# Altium schematic sheet _nRF9160.SchDoc: nRF9160, SIM and GPIOs
size A3; CompanyName: Nordic Semiconductor ASA; DrawnBy: EISK; SheetNumber: 2; SheetTotal: 4; DesignStatus: Prototype; Version: 0.1.2
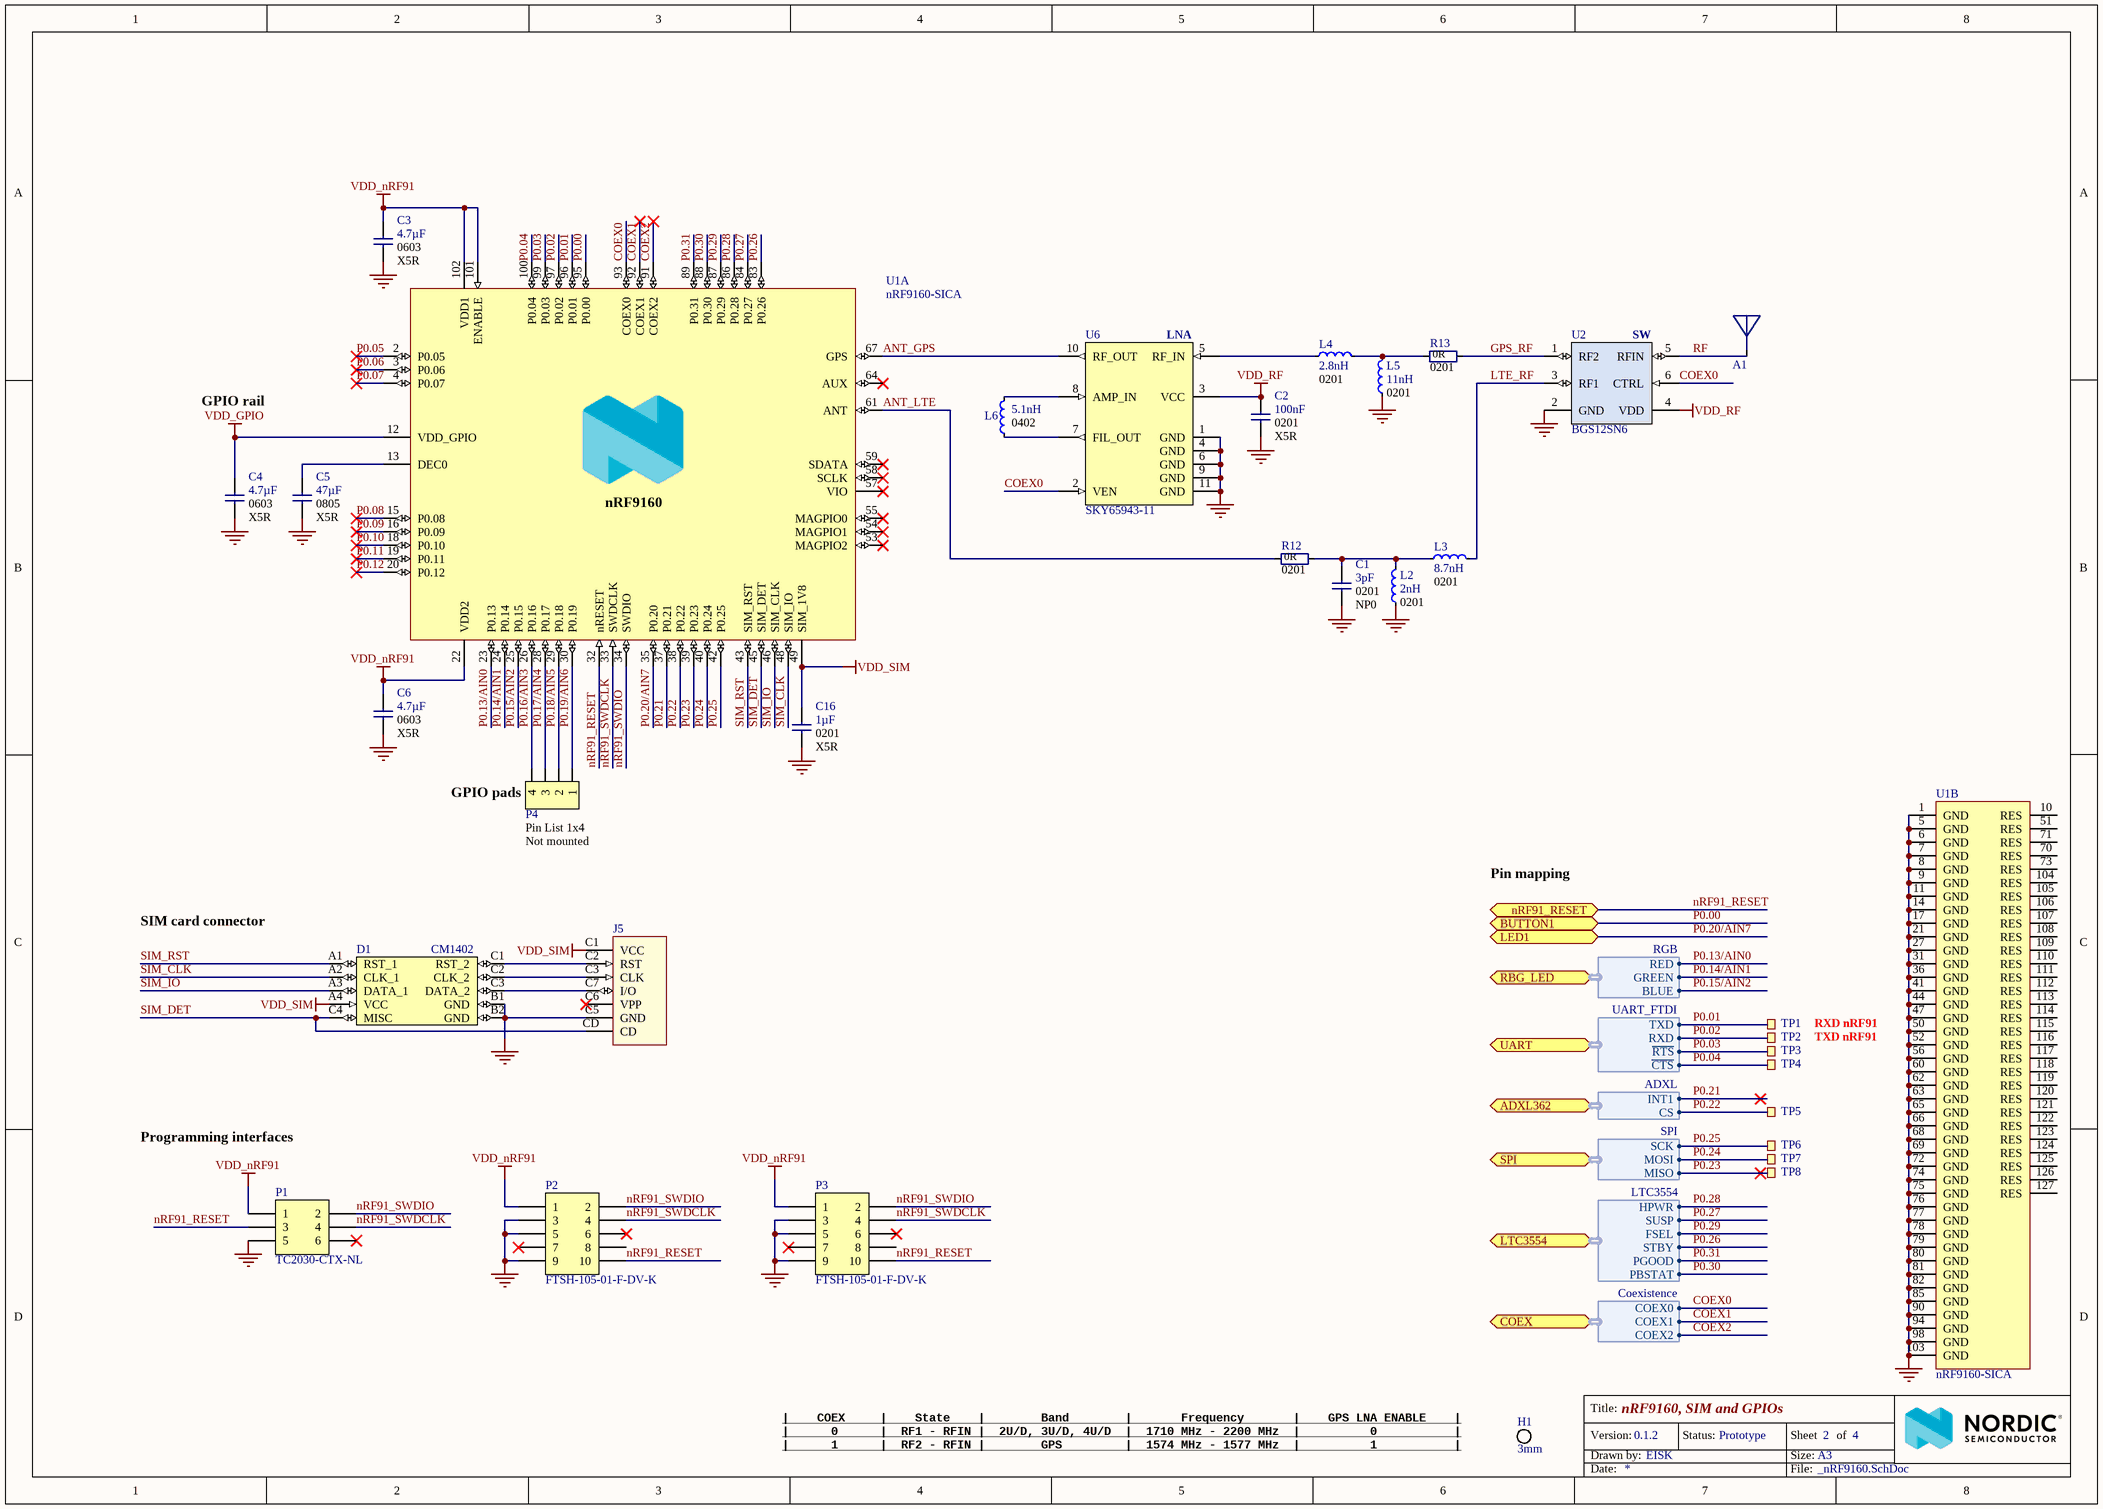
[diagram p0: _nRF9160.SchDoc]

## Parts
A1  FR01-S4-250  [FRACTUS_CUBE_mXTEND]  (value not drawn)
C1  3pF  Footprint Doc: 0201  TempCoeff: NP0  [CAPC0603X03L_C]
C2  100nF  Footprint Doc: 0201  TempCoeff: X5R  [CAPC0603X03L_C]
C3  4.7µF  Footprint Doc: 0603  TempCoeff: X5R  [CAPC1608X06L]
C4  4.7µF  Footprint Doc: 0603  TempCoeff: X5R  [CAPC1608X06L]
C5  47µF  Footprint Doc: 0805  TempCoeff: X5R  [CAPC2012X11L]
C6  4.7µF  Footprint Doc: 0603  TempCoeff: X5R  [CAPC1608X06L]
C16  1µF  Footprint Doc: 0201  TempCoeff: X5R  [CAPC0603X03L_C]
D1  CM1402  [CM1402]
H1  3mm  [HOLE_NP_3MM]  (no BOM)
J5  SIM8055-6-1-14-00-A_revA1  [GCT_SIM8055-6-1-14-00-A_revA1]  (value not drawn)
L2  2nH  Footprint Doc: 0201  [INDC0603X03L_C]
L3  8.7nH  Footprint Doc: 0201  [INDC0603X03L_C]
L4  2.8nH  Footprint Doc: 0201  [INDC0603X03L_C]
L5  11nH  Footprint Doc: 0201  [INDC0603X03L_C]
L6  5.1nH  Footprint Doc: 0402  [INDC1005X04L_WW]
P1  TC2030-CTX-NL  [TC2030-IDC-NLFP]  (no BOM)
P2  FTSH-105-01-F-DV-K  [HDR_2x5-SMD-1.27mm]  (no BOM)
P3  FTSH-105-01-F-DV-K  [HDR_2x5-SMD-1.27mm-K]  (no BOM)
P4  Pin List 1x4  Assembly: Not mounted  [LIST_1x4-NC]  (no BOM)
R12  0R  Footprint Doc: 0201  [RESC0603X03L_C]
R13  0R  Footprint Doc: 0201  [RESC0603X03L_C]
TP1  Ø1.0mm,SMD  [TP_SMD_Ø1.0mm]  (value not drawn)  (no BOM)
TP2  Ø1.0mm,SMD  [TP_SMD_Ø1.0mm]  (value not drawn)  (no BOM)
TP3  Ø1.0mm,SMD  [TP_SMD_Ø1.0mm]  (value not drawn)  (no BOM)
TP4  Ø1.0mm,SMD  [TP_SMD_Ø1.0mm]  (value not drawn)  (no BOM)
TP5  Ø1.0mm,SMD  [TP_SMD_Ø1.0mm]  (value not drawn)  (no BOM)
TP6  Ø1.0mm,SMD  [TP_SMD_Ø1.0mm]  (value not drawn)  (no BOM)
TP7  Ø1.0mm,SMD  [TP_SMD_Ø1.0mm]  (value not drawn)  (no BOM)
TP8  Ø1.0mm,SMD  [TP_SMD_Ø1.0mm]  (value not drawn)  (no BOM)
U1  nRF9160-SICA  [LGA50P1600X1050X104-161N]  (parts A,B of 2)
U2  BGS12SN6  [PG-TSNP-6-2]
U6  SKY65943-11  [SKY6594311]

## Ports
ADXL362 (bidir, harness ADXL), BUTTON1 (bidir), COEX (bidir, harness Coexistence), LED1 (bidir), LTC3554 (bidir, harness LTC3554), nRF91_RESET (bidir), RBG_LED (bidir, harness RGB), SPI (bidir, harness SPI), UART (bidir, harness UART_FTDI)

## Harnesses
SPI: MISO, MOSI, SCK
ADXL: CS, INT1
UART_FTDI: RXD, TXD, ~{CTS}, ~{RTS}
LTC3554: HPWR, SUSP, FSEL, STBY, PGOOD, PBSTAT
RGB: RED, GREEN, BLUE
Coexistence: COEX2, COEX1, COEX0

## Nets
GND: C1.2 C2.2 C3.2 C4.2 C5.2 C6.2 C16.2 D1.B1(GND) D1.B2(GND) J5.C5(GND) L2.1 L5.1 P1.5 P2.3 P2.5 P2.9 P3.3 P3.5 P3.9 U1.1(GND) U1.5(GND) U1.6(GND) U1.7(GND) U1.8(GND) U1.9(GND) U1.11(GND) U1.14(GND) U1.17(GND) U1.21(GND) U1.27(GND) U1.31(GND) U1.36(GND) U1.41(GND) U1.44(GND) U1.47(GND) U1.50(GND) U1.52(GND) U1.56(GND) U1.60(GND) U1.62(GND) U1.63(GND) U1.65(GND) U1.66(GND) U1.68(GND) U1.69(GND) U1.72(GND) U1.74(GND) U1.75(GND) U1.76(GND) U1.77(GND) U1.78(GND) U1.79(GND) U1.80(GND) U1.81(GND) U1.82(GND) U1.85(GND) U1.90(GND) U1.94(GND) U1.98(GND) U1.103(GND) U2.2(GND) U6.1(GND) U6.4(GND) U6.6(GND) U6.9(GND) U6.11(GND)
VDD_GPIO: C4.1 U1.12(VDD_GPIO)
VDD_nRF91: C3.1 C6.1 P1.1 P2.1 P3.1 U1.22(VDD2) U1.101(ENABLE) U1.102(VDD1)
VDD_RF: C2.1 U2.4(VDD) U6.3(VCC)
VDD_SIM: C16.1 D1.A4(VCC) J5.C1(VCC) U1.49(SIM_1V8)
ANT_GPS: U1.67(GPS) U6.10(RF_OUT)
ANT_LTE: R12.1 U1.61(ANT)
COEX0: U1.93(COEX0) U2.6(CTRL) U6.2(VEN) ; port COEX.COEX0
COEX1: U1.92(COEX1) ; port COEX.COEX1
COEX2: U1.91(COEX2) ; port COEX.COEX2
GPS_RF: R13.2 U2.1(RF2)
LTE_RF: L3.2 U2.3(RF1)
nRF91_RESET: P1.3 P2.10 P3.10 U1.32(nRESET) ; port nRF91_RESET
nRF91_SWDCLK: P1.4 P2.4 P3.4 U1.33(SWDCLK)
nRF91_SWDIO: P1.2 P2.2 P3.2 U1.34(SWDIO)
P0.00: U1.95(P0.00) ; port BUTTON1
P0.01: TP1.1 U1.96(P0.01) ; port UART.TXD
P0.02: TP2.1 U1.97(P0.02) ; port UART.RXD
P0.03: TP3.1 U1.99(P0.03) ; port UART.~{RTS}
P0.04: TP4.1 U1.100(P0.04) ; port UART.~{CTS}
P0.05: U1.2(P0.05)
P0.06: U1.3(P0.06)
P0.07: U1.4(P0.07)
P0.08: U1.15(P0.08)
P0.09: U1.16(P0.09)
P0.10: U1.18(P0.10)
P0.11: U1.19(P0.11)
P0.12: U1.20(P0.12)
P0.13/AIN0: U1.23(P0.13) ; port RBG_LED.RED
P0.14/AIN1: U1.24(P0.14) ; port RBG_LED.GREEN
P0.15/AIN2: U1.25(P0.15) ; port RBG_LED.BLUE
P0.16/AIN3: P4.4 U1.26(P0.16)
P0.17/AIN4: P4.3 U1.28(P0.17)
P0.18/AIN5: P4.2 U1.29(P0.18)
P0.19/AIN6: P4.1 U1.30(P0.19)
P0.20/AIN7: U1.35(P0.20) ; port LED1
P0.21: U1.37(P0.21) ; port ADXL362.INT1
P0.22: TP5.1 U1.38(P0.22) ; port ADXL362.CS
P0.23: TP8.1 U1.39(P0.23) ; port SPI.MISO
P0.24: TP7.1 U1.40(P0.24) ; port SPI.MOSI
P0.25: TP6.1 U1.42(P0.25) ; port SPI.SCK
P0.26: U1.83(P0.26) ; port LTC3554.STBY
P0.27: U1.84(P0.27) ; port LTC3554.SUSP
P0.28: U1.86(P0.28) ; port LTC3554.HPWR
P0.29: U1.87(P0.29) ; port LTC3554.FSEL
P0.30: U1.88(P0.30) ; port LTC3554.PBSTAT
P0.31: U1.89(P0.31) ; port LTC3554.PGOOD
RF: A1.1 U2.5(RFIN)
SIM_CLK: D1.A2(CLK_1) U1.48(SIM_IO)
SIM_DET: D1.C4(MISC) J5.CD U1.45(SIM_DET)
SIM_IO: D1.A3(DATA_1) U1.46(SIM_CLK)
SIM_RST: D1.A1(RST_1) U1.43(SIM_RST)
NetC1_1: C1.1 L2.2 L3.1 R12.2
NetC5_1: C5.1 U1.13(DEC0)
NetD1_C1: D1.C1(RST_2) J5.C2(RST)
NetD1_C2: D1.C2(CLK_2) J5.C3(CLK)
NetD1_C3: D1.C3(DATA_2) J5.C7(I/O)
NetL4_1: L4.1 U6.5(RF_IN)
NetL4_2: L4.2 L5.2 R13.1
NetL6_1: L6.1 U6.7(FIL_OUT)
NetL6_2: L6.2 U6.8(AMP_IN)

Not connected (* = marked no-connect by the designer): J5 C6(VPP)*; P1 6*; P2 6* 7* 8; P3 6* 7* 8; U1 10(RES) 51(RES) 53(MAGPIO2)* 54(MAGPIO1)* 55(MAGPIO0)* 57(VIO)* 58(SCLK)* 59(SDATA)* 64(AUX)* 70(RES) 71(RES) 73(RES) 104(RES) 105(RES) 106(RES) 107(RES) 108(RES) 109(RES) 110(RES) 111(RES) 112(RES) 113(RES) 114(RES) 115(RES) 116(RES) 117(RES) 118(RES) 119(RES) 120(RES) 121(RES) 122(RES) 123(RES) 124(RES) 125(RES) 126(RES) 127(RES)

## Notes on the sheet
- (near U6) LNA
- (near U2) SW
- GPIO rail
- (near P4) GPIO pads
- Pin mapping
- SIM card connector
- RXD nRF91
- TXD nRF91
- Programming interfaces
- (near H1) |    COEX     |    State    |        Band        |       Frequency       |    GPS LNA ENABLE    |
  |      0      |  RF1 - RFIN |  2U/D, 3U/D, 4U/D  |  1710 MHz - 2200 MHz  |          0           |
  |      1      |  RF2 - RFIN |        GPS         |  1574 MHz - 1577 MHz  |          1           |
- Title:
- Version:
- Drawn by:
- Status:
- Size:
- Sheet
- A3
- of
- Date:
- File:
- (in symbol nRF9160_SICA, part A) nRF9160

## Library data of the parts
A1 = ANT:CUBE_mXTEND: CUBE mXTEND Antenna Booster (GSM, UMTS, LTE); Manufacturer: Fractus Antennas S.L.; Supplier 1: Digi-Key; Supplier Part Number 1: 2115-FR01-S4-250CT-ND; Manufacturer Part Number: FR01-S4-250; ComponentLink1Description: Datasheet; ComponentLink1URL: https://www.fractusantennas.com/wp-content/uploads/2018/01/UM_FR01-S4-250.pdf; Value: FR01-S4-250; ComponentLink2Description: Digi-Key; ComponentLink2URL: https://www.digikey.no/product-detail/en/fractus-antennas-s-l/FR01-S4-250/2115-FR01-S4-250CT-ND/10108319
C1 = CAP:0201: Capacitor, NP0, ±10%, 10V; Artikkelnr Noca: N.A.; Manufacturer: *; Manufacturer Part Number: *; LatestRevisionDate: 2014-11-13; Pin Count: 2; Publisher: Nordic Semiconductor; Published: 2014-11-13; Value: 3pF; Note: 10V; HelpURL: *; Supplier 1: *; Supplier Part Number 1: *; Supplier 2: *; Supplier Part Number 2: *
C2 C16 = CAP:0201: Capacitor, X5R, ±10%, 10V; Artikkelnr Noca: N.A.; Manufacturer: *; Manufacturer Part Number: *; LatestRevisionDate: 2014-11-13; Pin Count: 2; Publisher: Nordic Semiconductor; Published: 2014-11-13; HelpURL: *; Supplier 1: *; Supplier Part Number 1: *; Supplier 2: *; Supplier Part Number 2: *
  C2: Value: 100nF; Note: *
  C16: Value: 1µF; Note: 10V
C3 C4 C6 = CAP:0603: Capacitor, X5R, ±10%, 6.3V; Artikkelnr Noca: N.A.; Manufacturer: *; Manufacturer Part Number: *; LatestRevisionDate: 2014-11-13; Pin Count: 2; Publisher: Nordic Semiconductor; Published: 2014-11-13; Value: 4.7µF; Note: 6.3V; HelpURL: *; Supplier 1: *; Supplier Part Number 1: *; Supplier 2: *; Supplier Part Number 2: *
C5 = CAP:0805: Capacitor, X5R, ±20%, 6.3V; Note: s; Artikkelnr Noca: N.A.; Manufacturer: *; Manufacturer Part Number: *; LatestRevisionDate: 2014-11-13; Pin Count: 2; Publisher: Nordic Semiconductor; Published: 2014-11-13; HelpURL: *; Supplier 1: *; Supplier Part Number 1: *; Supplier 2: *; Supplier Part Number 2: *; Value: 47µF
D1 = CM1402: EMI Network Filter Arrays SIM CARD EMI FILTER WITH ESD PROTECTION; Manufacturer: ON Semiconductor; Manufacturer Part Number: CM1402-03CP; Artikkelnr Noca: N.A.; Part Number: CM1402; Footprint Doc: CM1402; LatestRevisionDate: 2017-02-06; Publisher: Nordic Semiconductor; Published: 2017-02-06; Value: CM1402; Note: *; ComponentLink1URL: *; ComponentLink1Description: Datasheet; ComponentLink2URL: *; ComponentLink2Description: Supplier link; Pin Count: 10; Supplier 1: Mouser; Supplier Part Number 1: 748-CM1402-03CP; Supplier 2: Digi-Key; Supplier Part Number 2: CM1402-03CPOSCT-ND; Part number IPS: N.A.; Datasheet: http://www.onsemi.com/pub_link/Collateral/CM1402-D.PDF
H1 = HOLE:M3: Value: 3mm
J5 = SIM8055-6-1-14-00-A_revA1: Nano SIM Card Connector, Push-Pull Type, 6 Pin, SMT, Profile 1.35mm; Manufacturer: GCT; Manufacturer Part Number: SIM8055-6-1-14-00-A; Supplier: Digi-Key; Supplier Part Number: 2073-SIM8055-6-1-14-00-ADKR-ND; ComponentLink1Description: Information Page; ComponentLink1URL: https://gct.co/connector/digi-key/sim8055; ComponentLink2Description: Digi-Key; ComponentLink2URL: https://www.digikey.com/product-detail/en/gct/SIM8055-6-1-14-00-A/2073-SIM8055-6-1-14-00-ADKR-ND/9859771
L2-L5 = IND:0201: Inductor, 350mA, ±3%; Manufacturer: Murata; Manufacturer Part Number: *; HelpURL: *; LatestRevisionDate: 2017-07-19; Pin Count: 2; Publisher: Nordic Semiconductor; Published: 2013-04-10; Note: *; Supplier 1: *; Supplier Part Number 1: *; Supplier 2: *; Supplier Part Number 2: *
  L2: Value: 2nH
  L3: Value: 8.7nH
  L4: Value: 2.8nH
  L5: Value: 11nH
L6 = IND:Murata: Inductor, 600mA, ±0.1nH, 120mΩ, Q=25; Part Number: L0402-5n1-Wirewound-Murata; Manufacturer: Murata; Manufacturer Part Number: LQW15AN5N1B00; Note: -55°C ~ 125°C; Artikkelnr Noca: N.A.; ComponentLink1URL: https://search.murata.co.jp/Ceramy/image/img/P02/JELF243A-0050.pdf; ComponentLink1Description: Datasheet; ComponentLink2URL: *; ComponentLink2Description: Supplier link; HelpURL: https://psearch.en.murata.com/inductor/product/LQW15AN5N1B00%23.html; LatestRevisionDate: 2019-04-16; Pin Count: 2; Publisher: Nordic Semiconductor; Published: 2019-04-16; Value: 5.1nH; Supplier 1: Digi-Key; Supplier Part Number 1: 490-6831-1-ND; Part number IPS: N.A.
P1 = CONN-2x3_No_BOM: CBL PLUG-OF-NAILS 6-PIN; Manufacturer: Tag-Connect LLC; Artikkelnr Noca: N.A.; Part Number: TC2030-CTX-NL; Manufacturer Part Number: TC2030-CTX-NL; Datasheet: http://www.tag-connect.com/Materials/TC2030-IDC-NL.pdf; LatestRevisionDate: 2013-08-08; Pin Count: 6; Publisher: Nordic Semiconductor; Published: 2013-08-08; Value: TC2030-CTX-NL; Supplier: Tag-Connect; Supplier part number: TC2030-CTX-NL; 2nd source Supplier: *; 2nd source part number: *
P2 = Header 2x5 No-BOM: Connector Header Surface Mount 10 position 0.050" (1.27mm); Manufacturer: Samtec Inc.; Manufacturer Part Number: FTSH-105-01-F-DV-K; Value: FTSH-105-01-F-DV-K; Footprint: *; Package: *; Publisher: Nordic Semiconductor; 2nd Manufacturer Part Number: *; 2nd Manufacturer: *; LatestRevisionDate: 2018-10-15; Supplier 1: Digi-Key; Supplier Part Number 1: SAM8796-ND; Supplier 2: Newark; Supplier Part Number 2: 45P5160; Supplier 3: Farnell; Supplier Part Number 3: 2856430; Supplier 4: Mouser; Supplier Part Number 4: 200-FTSH10501FDVK
P3 = Header 2x5 Shielded SMD: Connector Header Surface Mount 10 position 0.050" (1.27mm); Manufacturer: Samtec Inc.; Manufacturer Part Number: FTSH-105-01-F-DV-K; Value: FTSH-105-01-F-DV-K; Footprint: *; Package: *; Publisher: Nordic Semiconductor; 2nd Manufacturer Part Number: *; 2nd Manufacturer: *; LatestRevisionDate: 2018-10-15; Supplier 1: Digi-Key; Supplier Part Number 1: SAM8796-ND; Supplier 2: Newark; Supplier Part Number 2: 45P5160; Supplier 3: Farnell; Supplier Part Number 3: 2856430; Supplier 4: Mouser; Supplier Part Number 4: 200-FTSH10501FDVK
P4 = CONN-4: Pin List 1x4, 2.54mm (100mil); Note: Pin List 1x4, N.C.; Footprint Doc: LIST_1x4; Pin Count: 4; Publisher: Nordic Semiconductor; Published: 2019-07-17; Value: Pin List 1x4
R12 R13 = RES:0201: Manufacturer: *; Manufacturer Part Number: *; Package: 0201; Publisher: Nordic Semiconductor; LatestRevisionDate: 2019-06-11; Value: 0R
TP1-TP8 = TESTPAD: 1.0mm circular SMD testpad; Manufacturer: Nordic Semiconductor; Footprint Doc: TP_SMD_Ø1.0mm; LatestRevisionDate: 2013-06-11; Pin Count: 1; Publisher: Nordic Semiconductor; Published: 2013-06-11; Value: Ø1.0mm,SMD; ComponentLink1URL: *; ComponentLink1Description: Datasheet; ComponentLink2URL: *; ComponentLink2Description: Supplier link
U1 = nRF9160_SICA: Low power System-in-Package with integrated LTE-M/NB-IoT modem and GPS; Manufacturer: Nordic Semiconductor; Artikkelnr Noca: N.A.; Part Number: nRF9160-SICA; Manufacturer Part Number: nRF9160-SICA; Footprint Doc: LGA-161; Pin Count: 161; Value: nRF9160-SICA; HelpURL: *; LatestRevisionDate: 2019-02-14; Publisher: Nordic Semiconductor; Published: 2019-02-14; Note: *; Part number IPS: N.A.; Supplier 1: Mouser; Supplier 2: Digi-Key; Supplier Part Number 1: 949-NRF9160-SICA-R; Supplier Part Number 2: 1490-1076-1-ND
U2 = BGS12SN6: Wideband RF SPDT Switch; Manufacturer: Infineon Technologies; Manufacturer Part Number: BGS12SN6; Footprint Doc: TSNP-6-2; ComponentLink1Description: Datasheet; ComponentLink1URL: https://www.infineon.comhttps://www.infineon.com/dgdl/Infineon-BGS12SN6-DS-v01_02-en.pdf?fileId=db3a30433f1b26e8013f2db58bc03856; ComponentLink3Description: Digi-Key BGS12SN6; ComponentLink3URL: https://www.digikey.com/product-detail/en/infineon-technologies/BGS12SN6E6327XTSA1/BGS12SN6E6327XTSA1CT-ND/5764851; Value: BGS12SN6; Supplier 1: Digi-Key; Supplier Part Number 1: BGS12SN6E6327XTSA1CT-ND
U6 = SKY65943-11: GNSS Low-Noise Amplifier Front-End Module with Integrated Pre-Filter and Post-Filter; Manufacturer: Skyworks; Artikkelnr Noca: N.A.; Part Number: SKY65943-11; Manufacturer Part Number: SKY65943-11; Footprint Doc: MCM-10; Pin Count: 10; Value: SKY65943-11; ComponentLink1URL: http://www.skyworksinc.com/uploads/documents/SKY65943_11_204404F.pdf; ComponentLink1Description: Datasheet; ComponentLink2URL: https://www.digikey.com/product-detail/en/skyworks-solutions-inc/SKY65943-11/863-2032-1-ND; ComponentLink2Description: Supplier link; HelpURL: http://www.skyworksinc.com/Product/3579/SKY65943-11; LatestRevisionDate: 2019-04-16; Publisher: Nordic Semiconductor; Published: 2019-04-16; Note: *; Supplier 1: Digi-Key; Supplier Part Number 1: 863-2032-1-ND; Supplier 2: Mouser; Supplier Part Number 2: 873-SKY65943-11; Part number IPS: N.A.